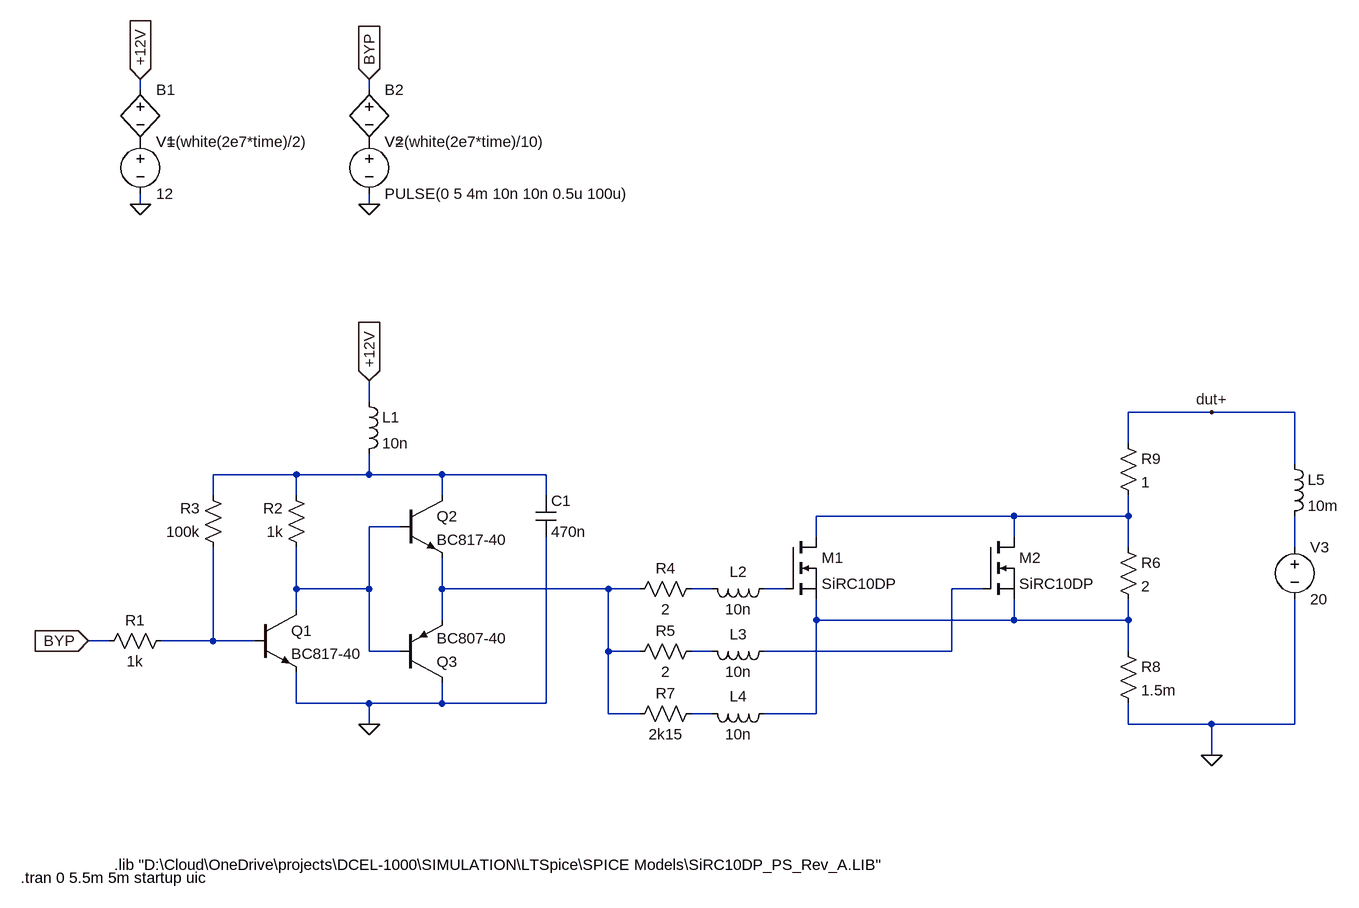
[diagram p0: schematic _Range Switch.asc]
_Range Switch.asc, the LTspice schematic file:
Version 4
SHEET 1 1916 680
WIRE 64 -688 64 -704
WIRE 416 -688 416 -704
WIRE 64 -512 64 -528
WIRE 416 -512 416 -528
WIRE 416 -208 416 -240
WIRE 1712 -192 1584 -192
WIRE 1840 -192 1712 -192
WIRE 1584 -144 1584 -192
WIRE 1840 -112 1840 -192
WIRE 304 -96 176 -96
WIRE 416 -96 416 -128
WIRE 416 -96 304 -96
WIRE 528 -96 416 -96
WIRE 688 -96 528 -96
WIRE 176 -64 176 -96
WIRE 304 -64 304 -96
WIRE 528 -64 528 -96
WIRE 688 -64 688 -96
WIRE 1408 -32 1104 -32
WIRE 1584 -32 1584 -64
WIRE 1584 -32 1408 -32
WIRE 464 -16 416 -16
WIRE 1104 0 1104 -32
WIRE 1408 0 1408 -32
WIRE 1584 16 1584 -32
WIRE 1840 16 1840 -32
WIRE 304 80 304 16
WIRE 416 80 416 -16
WIRE 416 80 304 80
WIRE 528 80 528 32
WIRE 784 80 528 80
WIRE 832 80 784 80
WIRE 944 80 912 80
WIRE 1056 80 1024 80
WIRE 1360 80 1312 80
WIRE 304 112 304 80
WIRE 528 128 528 80
WIRE 1104 128 1104 96
WIRE 1408 128 1408 96
WIRE 1408 128 1104 128
WIRE 1584 128 1584 96
WIRE 1584 128 1408 128
WIRE 16 160 -16 160
WIRE 176 160 176 16
WIRE 176 160 96 160
WIRE 240 160 176 160
WIRE 416 176 416 80
WIRE 464 176 416 176
WIRE 784 176 784 80
WIRE 832 176 784 176
WIRE 944 176 912 176
WIRE 1312 176 1312 80
WIRE 1312 176 1024 176
WIRE 1584 176 1584 128
WIRE 304 256 304 208
WIRE 416 256 304 256
WIRE 528 256 528 224
WIRE 528 256 416 256
WIRE 688 256 688 0
WIRE 688 256 528 256
WIRE 784 272 784 176
WIRE 832 272 784 272
WIRE 944 272 912 272
WIRE 1104 272 1104 128
WIRE 1104 272 1024 272
WIRE 416 288 416 256
WIRE 1584 288 1584 256
WIRE 1712 288 1584 288
WIRE 1840 288 1840 96
WIRE 1840 288 1712 288
WIRE 1712 336 1712 288
FLAG 416 288 0
FLAG 416 -240 +12V
IOPIN 416 -240 In
FLAG -16 160 BYP
IOPIN -16 160 In
FLAG 1712 336 0
FLAG 1712 -192 dut+
FLAG 64 -512 0
FLAG 64 -704 +12V
IOPIN 64 -704 In
FLAG 416 -512 0
FLAG 416 -704 BYP
IOPIN 416 -704 In
SYMBOL res 112 144 R90
WINDOW 0 0 56 VBottom 2
WINDOW 3 32 56 VTop 2
SYMATTR InstName R1
SYMATTR Value 1k
SYMBOL res 320 32 R180
WINDOW 0 36 76 Left 2
WINDOW 3 36 40 Left 2
SYMATTR InstName R2
SYMATTR Value 1k
SYMBOL res 192 32 R180
WINDOW 0 36 76 Left 2
WINDOW 3 36 40 Left 2
SYMATTR InstName R3
SYMATTR Value 100k
SYMBOL npn 240 112 R0
SYMATTR InstName Q1
SYMATTR Value BC817-40
SYMBOL npn 464 -64 R0
SYMATTR InstName Q2
SYMATTR Value BC817-40
SYMBOL pnp 464 224 M180
SYMATTR InstName Q3
SYMATTR Value BC807-40
SYMBOL cap 672 -64 R0
SYMATTR InstName C1
SYMATTR Value 470n
SYMATTR SpiceLine V=50 Rser=1m Lser=700p
SYMBOL ind 400 -224 R0
SYMATTR InstName L1
SYMATTR Value 10n
SYMBOL nmos 1056 0 R0
SYMATTR InstName M1
SYMATTR Value SiRC10DP
SYMATTR Prefix X
SYMBOL nmos 1360 0 R0
SYMATTR InstName M2
SYMATTR Value SiRC10DP
SYMATTR Prefix X
SYMBOL res 928 64 R90
WINDOW 0 0 56 VBottom 2
WINDOW 3 32 56 VTop 2
SYMATTR InstName R4
SYMATTR Value 2
SYMBOL ind 1040 64 R90
WINDOW 0 5 56 VBottom 2
WINDOW 3 32 56 VTop 2
SYMATTR InstName L2
SYMATTR Value 10n
SYMBOL res 928 160 R90
WINDOW 0 0 56 VBottom 2
WINDOW 3 32 56 VTop 2
SYMATTR InstName R5
SYMATTR Value 2
SYMBOL ind 1040 160 R90
WINDOW 0 5 56 VBottom 2
WINDOW 3 32 56 VTop 2
SYMATTR InstName L3
SYMATTR Value 10n
SYMBOL res 1568 0 R0
SYMATTR InstName R6
SYMATTR Value 2
SYMBOL res 928 256 R90
WINDOW 0 0 56 VBottom 2
WINDOW 3 32 56 VTop 2
SYMATTR InstName R7
SYMATTR Value 2k15
SYMBOL ind 1040 256 R90
WINDOW 0 5 56 VBottom 2
WINDOW 3 32 56 VTop 2
SYMATTR InstName L4
SYMATTR Value 10n
SYMBOL res 1568 160 R0
SYMATTR InstName R8
SYMATTR Value 1.5m
SYMBOL ind 1824 -128 R0
SYMATTR InstName L5
SYMATTR Value 10m
SYMBOL voltage 64 -624 R0
WINDOW 123 0 0 Left 0
WINDOW 39 0 0 Left 0
SYMATTR InstName V1
SYMATTR Value 12
SYMBOL bv 64 -704 R0
SYMATTR InstName B1
SYMATTR Value V=(white(2e7*time)/2)
SYMBOL voltage 416 -624 R0
WINDOW 123 0 0 Left 0
WINDOW 39 0 0 Left 0
SYMATTR InstName V2
SYMATTR Value PULSE(0 5 4m 10n 10n 0.5u 100u)
SYMBOL bv 416 -704 R0
SYMATTR InstName B2
SYMATTR Value V=(white(2e7*time)/10)
SYMBOL voltage 1840 0 R0
WINDOW 123 0 0 Left 0
WINDOW 39 0 0 Left 0
SYMATTR InstName V3
SYMATTR Value 20
SYMBOL res 1568 -160 R0
SYMATTR InstName R9
SYMATTR Value 1
TEXT 24 504 Left 2 !.lib "D:\\Cloud\\OneDrive\\projects\\DCEL-1000\\SIMULATION\\LTSpice\\SPICE Models\\SiRC10DP_PS_Rev_A.LIB"
TEXT -120 524 Left 2 !.tran 0 5.5m 5m startup uic

The netlist it stands for:
* _Range Switch.asc
R1 N010 BYP 1k
R2 N003 N001 1k
R3 N010 N001 100k
Q1 N003 N010 0 0 BC817-40
Q2 N001 N003 N005 0 BC817-40
Q3 0 N003 N005 0 BC807-40
C1 N001 0 470n V=50 Rser=1m Lser=700p
L1 +12V N001 10n
XM1 N002 N007 N009 SiRC10DP  ; pins D G S
XM2 N002 N008 N009 SiRC10DP  ; pins D G S
R4 N006 N005 2
L2 N007 N006 10n
R5 N011 N005 2
L3 N008 N011 10n
R6 N002 N009 2
R7 N012 N005 2k15
L4 N009 N012 10n
R8 N009 0 1.5m
L5 dut+ N004 10m
V1 P001 0 12
B1 +12V P001 V=(white(2e7*time)/2)
V2 P002 0 PULSE(0 5 4m 10n 10n 0.5u 100u)
B2 BYP P002 V=(white(2e7*time)/10)
V3 N004 0 20
R9 dut+ N002 1
.model NPN NPN
.model PNP PNP
.lib standard.bjt
.lib "D:\Cloud\OneDrive\projects\DCEL-1000\SIMULATION\LTSpice\SPICE Models\SiRC10DP_PS_Rev_A.LIB"
.tran 0 5.5m 5m startup uic
.backanno
.end